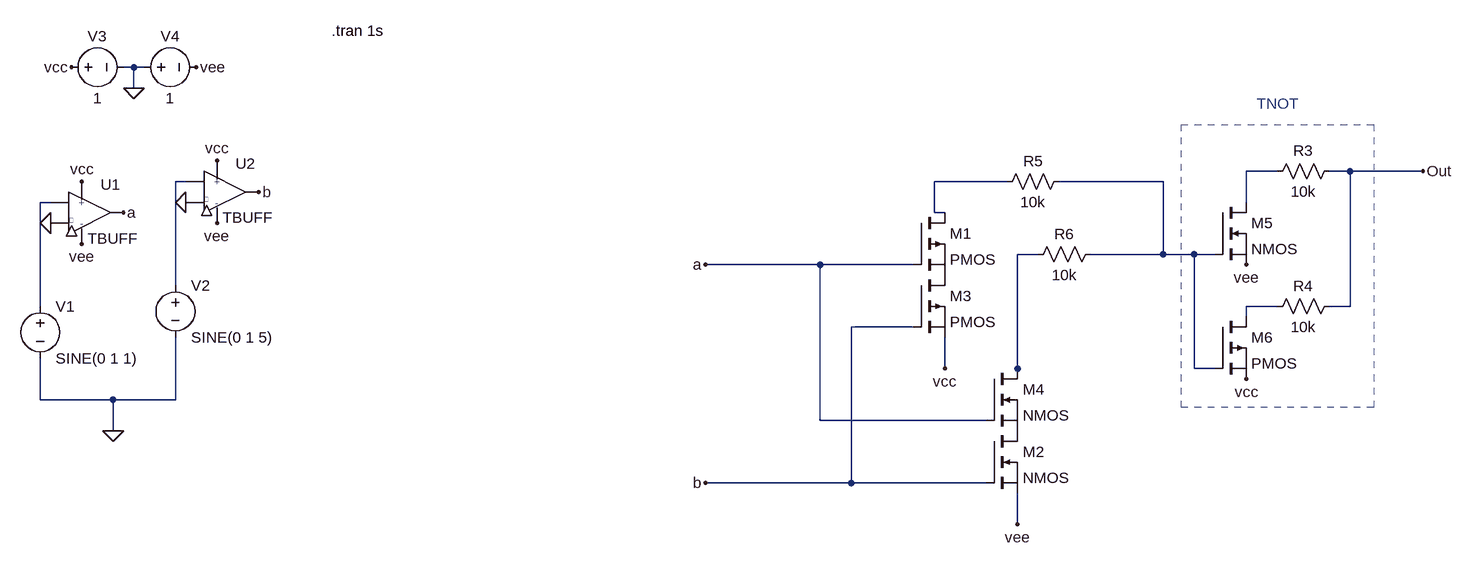
[diagram p0: schematic test4.asc]
test4.asc, the LTspice schematic file:
Version 4
SHEET 1 1456 680
WIRE -1504 -624 -1520 -624
WIRE -1488 -624 -1504 -624
WIRE -1504 -592 -1504 -624
WIRE 256 -464 208 -464
WIRE 368 -464 336 -464
WIRE 480 -464 368 -464
WIRE -1424 -448 -1440 -448
WIRE -160 -448 -272 -448
WIRE 80 -448 -80 -448
WIRE -1632 -416 -1648 -416
WIRE 208 -416 208 -464
WIRE -272 -400 -272 -448
WIRE -256 -400 -272 -400
WIRE -112 -336 -144 -336
WIRE 80 -336 80 -448
WIRE 80 -336 -32 -336
WIRE 128 -336 80 -336
WIRE 160 -336 128 -336
WIRE -448 -320 -624 -320
WIRE -304 -320 -448 -320
WIRE -1440 -288 -1440 -448
WIRE -1648 -256 -1648 -416
WIRE 256 -256 208 -256
WIRE 368 -256 368 -464
WIRE 368 -256 336 -256
WIRE 208 -240 208 -256
WIRE -304 -224 -400 -224
WIRE -256 -160 -256 -208
WIRE -144 -160 -144 -336
WIRE 128 -160 128 -336
WIRE 160 -160 128 -160
WIRE -144 -144 -144 -160
WIRE -1648 -112 -1648 -176
WIRE -1536 -112 -1648 -112
WIRE -1440 -112 -1440 -208
WIRE -1440 -112 -1536 -112
WIRE -448 -80 -448 -320
WIRE -192 -80 -448 -80
WIRE -1536 -64 -1536 -112
WIRE -400 16 -400 -224
WIRE -400 16 -624 16
WIRE -192 16 -400 16
WIRE -144 80 -144 32
FLAG -144 80 vee
FLAG -624 -320 a
FLAG -624 16 b
FLAG -256 -160 vcc
FLAG 208 -320 vee
FLAG 480 -464 Out
FLAG 208 -144 vcc
FLAG -1520 -400 a
FLAG -1312 -432 b
FLAG -1424 -416 0
FLAG -1632 -384 0
FLAG -1584 -448 vcc
FLAG -1376 -480 vcc
FLAG -1376 -384 vee
FLAG -1584 -352 vee
FLAG -1536 -64 0
FLAG -1408 -624 vee
FLAG -1600 -624 vcc
FLAG -1504 -592 0
SYMBOL pmos -304 -400 R0
SYMATTR InstName M1
SYMBOL nmos -192 -64 R0
SYMATTR InstName M2
SYMBOL pmos -304 -304 R0
SYMATTR InstName M3
SYMBOL nmos -192 -160 R0
SYMATTR InstName M4
SYMBOL nmos 160 -416 R0
SYMATTR InstName M5
SYMBOL Res 352 -480 R90
WINDOW 0 0 56 VBottom 2
WINDOW 3 32 56 VTop 2
SYMATTR InstName R3
SYMATTR Value 10k
SYMBOL pmos 160 -240 R0
SYMATTR InstName M6
SYMBOL Res 352 -272 R90
WINDOW 0 0 56 VBottom 2
WINDOW 3 32 56 VTop 2
SYMATTR InstName R4
SYMATTR Value 10k
SYMBOL Res -64 -464 R90
WINDOW 0 0 56 VBottom 2
WINDOW 3 32 56 VTop 2
SYMATTR InstName R5
SYMATTR Value 10k
SYMBOL Res -16 -352 R90
WINDOW 0 0 56 VBottom 2
WINDOW 3 32 56 VTop 2
SYMATTR InstName R6
SYMATTR Value 10k
SYMBOL voltage -1648 -272 R0
SYMATTR InstName V1
SYMATTR Value SINE(0 1 1)
SYMBOL voltage -1440 -304 R0
SYMATTR InstName V2
SYMATTR Value SINE(0 1 5)
SYMBOL TBUFF -1568 -400 R0
SYMATTR InstName U1
SYMBOL TBUFF -1360 -432 R0
SYMATTR InstName U2
SYMBOL voltage -1616 -624 R270
WINDOW 0 32 56 VTop 2
WINDOW 3 -32 56 VBottom 2
SYMATTR InstName V3
SYMATTR Value 1
SYMBOL voltage -1504 -624 R270
WINDOW 0 32 56 VTop 2
WINDOW 3 -32 56 VBottom 2
SYMATTR InstName V4
SYMATTR Value 1
TEXT 224 -568 Left 2 ;TNOT
TEXT -1200 -680 Left 2 !.tran 1s
RECTANGLE Normal 108 -536 404 -100 2

The netlist it stands for:
* test4.asc
M1 N003 a P001 P001 PMOS
M2 P002 b vee vee NMOS
M3 P001 b vcc vcc PMOS
M4 N006 a P002 P002 NMOS
M5 N001 N004 vee vee NMOS
R3 Out N001 10k
M6 N007 N004 vcc vcc PMOS
R4 Out N007 10k
R5 N004 N003 10k
R6 N004 N006 10k
V1 N005 0 SINE(0 1 1)
V2 N002 0 SINE(0 1 5)
XU1 N005 vcc vee a 0 TBUFF  ; pins in vcc vee out gnd
XU2 N002 vcc vee b 0 TBUFF  ; pins in vcc vee out gnd
V3 vcc 0 1
V4 0 vee 1
.model NMOS NMOS
.model PMOS PMOS
.lib standard.mos
* TNOT
.tran 1s
.lib /Users/manoelribeiroalmeida/dev/trit/LTspice/TBUFF.sub
.backanno
.end